# EAGLE schematic treiber (EAGLE 6.4)
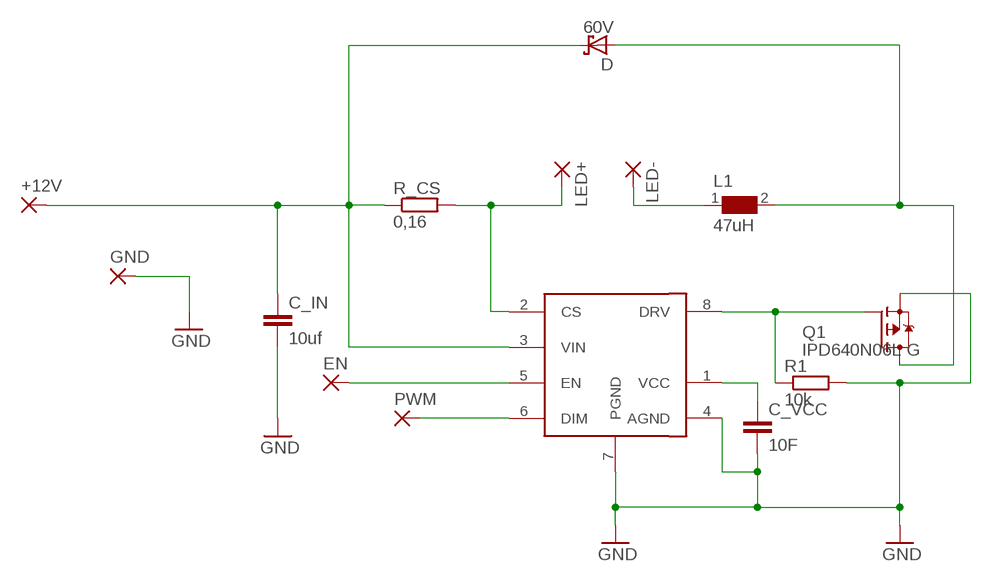
[diagram p0: schematic, sheet 1]

## Parts
+12V  WIREPADSMD5-2,5  [5-2,5]
C_IN  10uf  C-EUC1210  [C1210]
C_VCC  10F  C-EUC1210  [C1210]
D  60V  SCHOTTKY-DIODESMC  [SMC]
EN  WIREPADSMD5-2,5  [5-2,5]
GND  WIREPADSMD5-2,5  [5-2,5]
L1  47uH  WE-TPC-744066680_1028/1038  [WE-TPC_1028/1038]
LED+  WIREPADSMD5-2,5  [5-2,5]
LED-  WIREPADSMD5-2,5  [5-2,5]
MIC3203  MIC3203  [SO08]
PWM  WIREPADSMD5-2,5  [5-2,5]
Q1  IPD640N06L G  FDD4141TO252  [TO252]
R1  10k  R-EU_M1206  [M1206]
R_CS  0,16  R-EU_R0603  [R0603]

## Nets
GND: C_IN.2 C_VCC.2 GND.1(P) MIC3203.4(AGND) MIC3203.7(PGND) Q1.2(S) R1.2
IRFU: MIC3203.8(DRV) Q1.1(G) R1.1
N$1: L1.1 LED-.1(P)
N$2: +12V.1(P) C_IN.1 D.C MIC3203.3(VIN) R_CS.1
N$3: D.A L1.2 Q1.3(D)
N$4: LED+.1(P) MIC3203.2(CS) R_CS.2
N$5: C_VCC.1 MIC3203.1(VCC)
N$6: EN.1(P) MIC3203.5(EN)
PWM: MIC3203.6(DIM) PWM.1(P)

## Library data of the parts
+12V EN GND LED+ LED- PWM = wirepad:WIREPAD: Wire PAD connect wire on PCB
C_IN C_VCC = resistor:C-EU: CAPACITOR, European symbol
D = diode:SCHOTTKY-DIODE: Schottky Diode
L1 = WE-TPC:WE-TPC: Shielded Tiny Power Inductor WE-TPC - Extremely flat power inductor - High current capability - High reliability and perfect soldering characteristics because of integrated soldering pad - magnetically shielded -- Portable power like PDA, digital camera, PCMICA-cards and displays -- DC/DC-converter -- Recommended for switching regulator IC's from Linear Technology, National Semiconductor, Texas Instruments and Fairchild Semiconductor; MPN: 744066680; OC_FARNELL: 2082588; OC_NEWARK: 88T7031; PACKAGE: 1038; SUPPLIER: WURTH ELEKTRONIK
MIC3203 = micrel:MIC3203
Q1 = transistor-fet:FDD4141: P-Channel PowerTrench® MOSFET Source: FDD4141.pdf
R1 R_CS = resistor:R-EU_: RESISTOR, European symbol